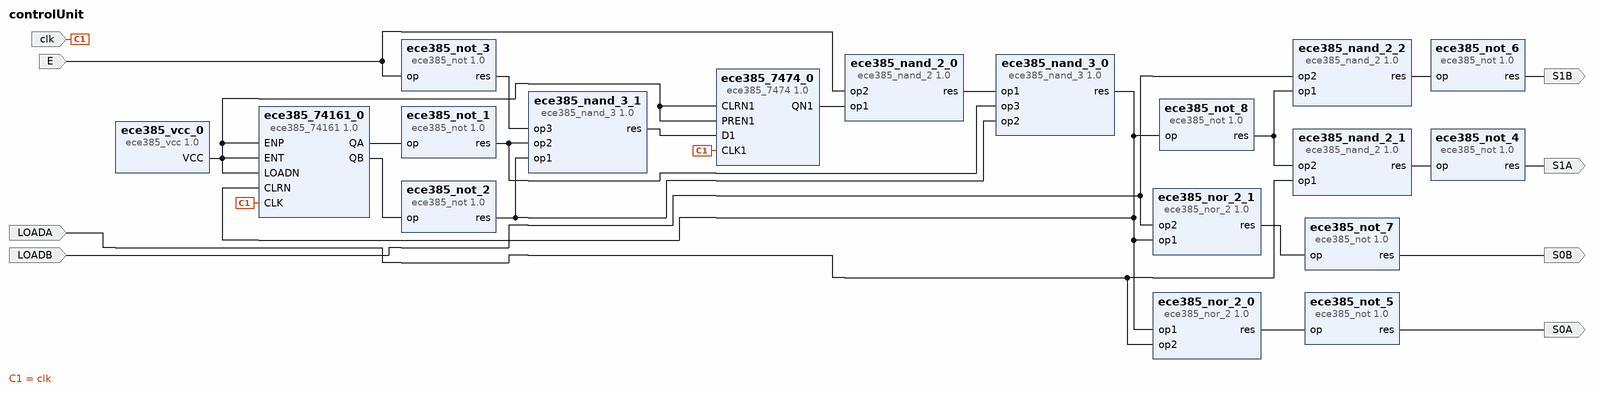
[diagram p0: block diagram of the top level]
# Vivado block design controlUnit, xc7s50csga324-1, Vivado 2022.2
create_bd_design controlUnit

create_bd_port -dir I clk
create_bd_port -dir I E
create_bd_port -dir I LOADA
create_bd_port -dir O S1A
create_bd_port -dir O S0A
create_bd_port -dir O S1B
create_bd_port -dir O S0B
create_bd_port -dir I LOADB

create_bd_cell -type ip -vlnv ece.illinois.edu:ece385:ece385_74161:1.0 ece385_74161_0
create_bd_cell -type ip -vlnv ece.illinois.edu:ece385:ece385_7474:1.0 ece385_7474_0
create_bd_cell -type ip -vlnv ece.illinois.edu:ece385:ece385_vcc:1.0 ece385_vcc_0
create_bd_cell -type ip -vlnv ece.illinois.edu:ece385:ece385_nand_3:1.0 ece385_nand_3_0
create_bd_cell -type ip -vlnv ece.illinois.edu:ece385:ece385_nand_3:1.0 ece385_nand_3_1
create_bd_cell -type ip -vlnv ece.illinois.edu:ece385:ece385_not:1.0 ece385_not_1
create_bd_cell -type ip -vlnv ece.illinois.edu:ece385:ece385_not:1.0 ece385_not_2
create_bd_cell -type ip -vlnv ece.illinois.edu:ece385:ece385_nand_2:1.0 ece385_nand_2_0
create_bd_cell -type ip -vlnv ece.illinois.edu:ece385:ece385_not:1.0 ece385_not_3
create_bd_cell -type ip -vlnv ece.illinois.edu:ece385:ece385_nand_2:1.0 ece385_nand_2_1
create_bd_cell -type ip -vlnv ece.illinois.edu:ece385:ece385_nand_2:1.0 ece385_nand_2_2
create_bd_cell -type ip -vlnv ece.illinois.edu:ece385:ece385_nor_2:1.0 ece385_nor_2_0
create_bd_cell -type ip -vlnv ece.illinois.edu:ece385:ece385_nor_2:1.0 ece385_nor_2_1
create_bd_cell -type ip -vlnv ece.illinois.edu:ece385:ece385_not:1.0 ece385_not_4
create_bd_cell -type ip -vlnv ece.illinois.edu:ece385:ece385_not:1.0 ece385_not_5
create_bd_cell -type ip -vlnv ece.illinois.edu:ece385:ece385_not:1.0 ece385_not_6
create_bd_cell -type ip -vlnv ece.illinois.edu:ece385:ece385_not:1.0 ece385_not_7
create_bd_cell -type ip -vlnv ece.illinois.edu:ece385:ece385_not:1.0 ece385_not_8

# ---- connections ----

connect_bd_net [get_bd_ports E] [get_bd_pins ece385_nand_2_0/op2] [get_bd_pins ece385_not_3/op]
connect_bd_net [get_bd_ports LOADA] [get_bd_pins ece385_nand_2_1/op1] [get_bd_pins ece385_nor_2_0/op2]
connect_bd_net [get_bd_ports LOADB] [get_bd_pins ece385_nand_2_2/op2] [get_bd_pins ece385_nor_2_1/op2]
connect_bd_net [get_bd_ports clk] [get_bd_pins ece385_7474_0/CLK1] [get_bd_pins ece385_74161_0/CLK]
connect_bd_net [get_bd_pins ece385_74161_0/QA] [get_bd_pins ece385_not_1/op]
connect_bd_net [get_bd_pins ece385_74161_0/QB] [get_bd_pins ece385_not_2/op]
connect_bd_net [get_bd_pins ece385_7474_0/QN1] [get_bd_pins ece385_nand_2_0/op1]
connect_bd_net [get_bd_pins ece385_nand_2_0/res] [get_bd_pins ece385_nand_3_0/op1]
connect_bd_net [get_bd_pins ece385_nand_2_1/res] [get_bd_pins ece385_not_4/op]
connect_bd_net [get_bd_pins ece385_nand_2_2/res] [get_bd_pins ece385_not_6/op]
connect_bd_net [get_bd_pins ece385_nand_3_0/res] \
  [get_bd_pins ece385_74161_0/CLRN] [get_bd_pins ece385_not_8/op] [get_bd_pins ece385_nor_2_0/op1] \
  [get_bd_pins ece385_nor_2_1/op1]
connect_bd_net [get_bd_pins ece385_nand_3_1/res] [get_bd_pins ece385_7474_0/D1]
connect_bd_net [get_bd_pins ece385_nor_2_0/res] [get_bd_pins ece385_not_5/op]
connect_bd_net [get_bd_pins ece385_nor_2_1/res] [get_bd_pins ece385_not_7/op]
connect_bd_net [get_bd_pins ece385_not_1/res] [get_bd_pins ece385_nand_3_0/op3] [get_bd_pins ece385_nand_3_1/op2]
connect_bd_net [get_bd_pins ece385_not_2/res] [get_bd_pins ece385_nand_3_0/op2] [get_bd_pins ece385_nand_3_1/op1]
connect_bd_net [get_bd_pins ece385_not_3/res] [get_bd_pins ece385_nand_3_1/op3]
connect_bd_net [get_bd_pins ece385_not_4/res] [get_bd_ports S1A]
connect_bd_net [get_bd_pins ece385_not_5/res] [get_bd_ports S0A]
connect_bd_net [get_bd_pins ece385_not_6/res] [get_bd_ports S1B]
connect_bd_net [get_bd_pins ece385_not_7/res] [get_bd_ports S0B]
connect_bd_net [get_bd_pins ece385_not_8/res] [get_bd_pins ece385_nand_2_1/op2] [get_bd_pins ece385_nand_2_2/op1]
connect_bd_net [get_bd_pins ece385_vcc_0/VCC] \
  [get_bd_pins ece385_7474_0/CLRN1] [get_bd_pins ece385_7474_0/PREN1] [get_bd_pins ece385_74161_0/ENP] \
  [get_bd_pins ece385_74161_0/ENT] [get_bd_pins ece385_74161_0/LOADN]

validate_bd_design
save_bd_design
